# EAGLE design SatelliteDevBoard (EAGLE 7.7.0)
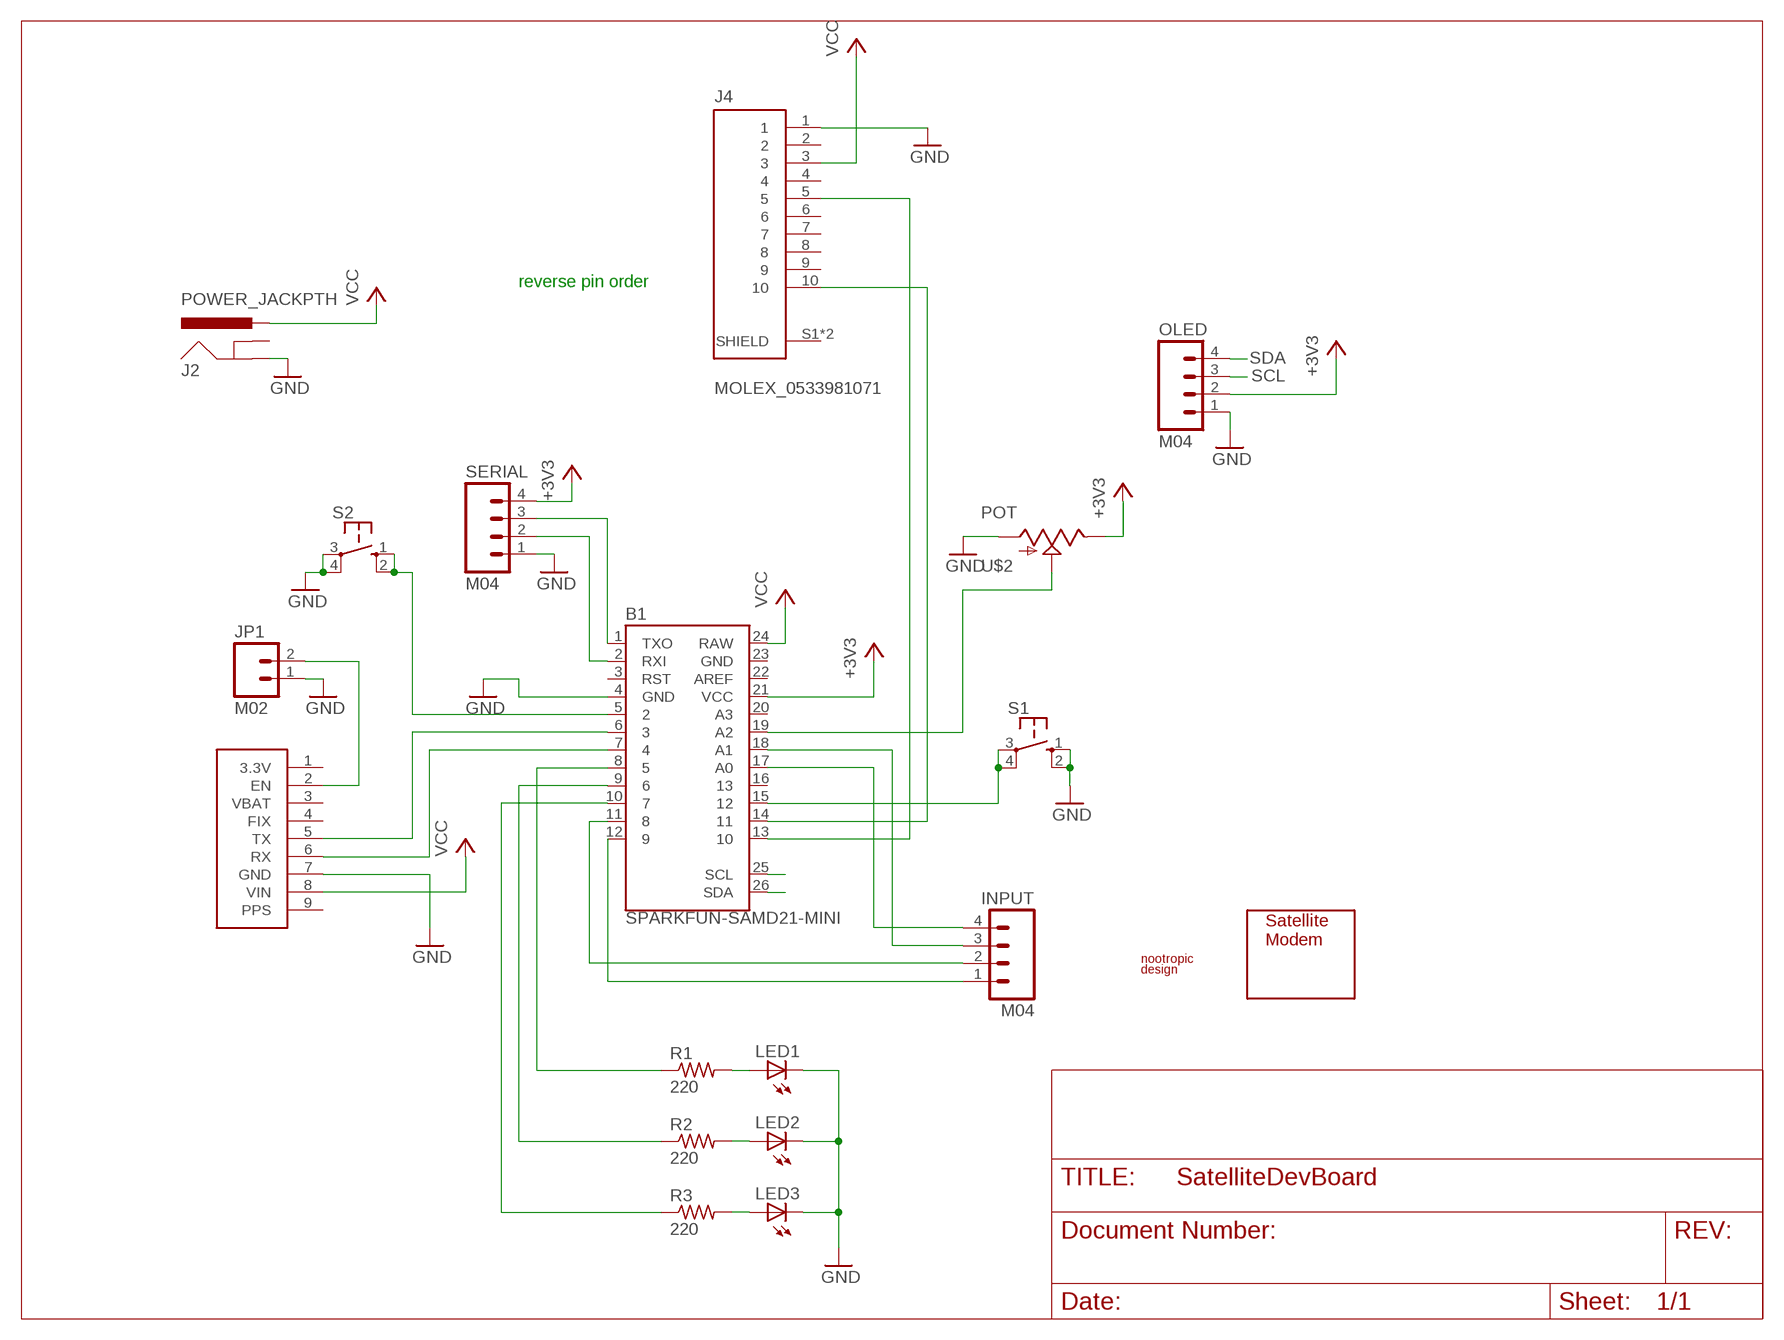
[diagram p0: schematic, sheet 1]

## Parts
B1  SPARKFUN-SAMD21-MINI  [SPARKFUN-SAMD21-MINI]
INPUT  M04  [1X04]
J2  POWER_JACKPTH  [POWER_JACK_PTH]
J4  MOLEX_0533981071  [MOLEX_0533981071]
JP1  M02  [1X02]
LED1  LED3MM  [LED3MM]
LED2  LED3MM  [LED3MM]
LED3  LED3MM  [LED3MM]
OLED  M04  [1X04]
R1  220  R-US  [0207/10]
R2  220  R-US  [0207/10]
R3  220  R-US  [0207/10]
S1  SWITCH-TACT  [SWITCH-TACT]
S2  SWITCH-TACT  [SWITCH-TACT]
SERIAL  M04  [1X04]
U$1  ROCKBLOCK-9603  [ROCKBLOCK-9603]
U$2  POT  [TRIMMERPOT]
U$3  ADAFRUIT-ULTIMATE-GPS-MODULE  [ADAFRUIT-ULTIMATE-GPS]
U$4  LOGO  [LOGO_SMALL]

## Nets
+3V3: B1.21(VCC) OLED.2 SERIAL.4 U$2.3
A0: B1.17(A0) INPUT.4
A1: B1.18(A1) INPUT.3
D5: B1.8 R1.1
D6: B1.9 R2.1
D7: B1.10 R3.1
D8: B1.11 INPUT.2
D9: B1.12 INPUT.1
D12: B1.15 S1.3(P) S1.4(P1)
GND: B1.4(GND) J2.GND J4.1 JP1.1 LED1.K(C) LED2.K(C) LED3.K(C) OLED.1 S1.1(S) S1.2(S1) S2.3(P) S2.4(P1) SERIAL.1 U$2.1 U$3.7(GND)
MODEM_RX: B1.13 J4.5
MODEM_TX: B1.14 J4.10
N$1: LED1.A R1.2
N$2: LED2.A R2.2
N$3: JP1.2 U$3.2(EN)
N$4: B1.6 U$3.5(TX)
N$5: B1.7 U$3.6(RX)
N$7: LED3.A R3.2
N$9: B1.5 S2.1(S) S2.2(S1)
N$12: B1.19(A2) U$2.2(WIPER)
RX: B1.2(RXI) SERIAL.2
SCL: B1.25(SCL) OLED.3
SDA: B1.26(SDA) OLED.4
TX: B1.1(TXO) SERIAL.3
VCC: B1.24(RAW) J2.PWR J4.3 U$3.8(VIN)
Unconnected: B1.3(RST) B1.16 B1.20(A3) B1.22(AREF) J2.GNDBREAK J4.2 J4.4 J4.6 J4.7 J4.8 J4.9 J4.S1(SHIELD) J4.S2(SHIELD) U$2.4(WIPER) U$3.1(3.3V) U$3.4(FIX) U$3.9(PPS)

## Notes on the sheet
- reverse pin order

## Power pins joined to a net without a drawn wire
GND: B1.23(GND)
VBAT: U$3.3(VBAT)

## Library data of the parts
B1 = nootropicdesign:SPARKFUN-SAMD21-MINI: SparkFun Pro Mini Pro Mini compatible footprint. Dimensions: 0.7 x 1.3" PCB Thickness: 0.8mm SparkFun Products: 3.3V/8MHz <https://www.sparkfun.com/products/11114> 5V/16MHz <https://www.sparkfun.com/products/11113>
INPUT OLED SERIAL = nootropicdesign:M04: 4-pin header
J2 = nootropicdesign:POWER_JACK: Power Jack This is the standard 5.5mm barrel jack for power. The PTH is the most common, proven, reliable, footprint. The Slot footprint only works if the mill layer is transmitted to the PCB fab house so be warned. Spark Fun Electronics SKU : PRT-00119 SMT: CONN-08106 Mating wall wart : TOL-00298 (and others)
J4 = nootropicdesign:MOLEX_0533981071: CONN HEADER 10POS 1.25MM VERT SMD
JP1 = nootropicdesign:M02: 2-pin header
LED1-LED3 = nootropicdesign:LED: LED OSRAM: - CHIPLED LG R971, LG N971, LY N971, LG Q971, LY Q971, LO R971, LY R971 LH N974, LH R974 LS Q976, LO Q976, LY Q976 LO Q996 - Hyper CHIPLED LW Q18S LB Q993, LB Q99A, LB R99A - SideLED LS A670, LO A670, LY A670, LG A670, LP A670 LB A673, LV A673, LT A673, LW A673 LH A674 LY A675 LS A676, LA A676, LO A676, LY A676, LW A676 LS A679, LY A679, LG A679 - Hyper Micro SIDELED® LS Y876, LA Y876, LO Y876, LY Y876 LT Y87S - SmartLED LW L88C, LW L88S LB L89C, LB L89S, LG L890 LS L89K, LO L89K, LY L89K LS L896, LA L896, LO L896, LY L896 - TOPLED LS T670, LO T670, LY T670, LG T670, LP T670 LSG T670, LSP T670, LSY T670, LOP T670, LYG T670 LG T671, LOG T671, LSG T671 LB T673, LV T673, LT T673, LW T673 LH T674 LS T676, LA T676, LO T676, LY T676, LB T676, LH T676, LSB T676, LW T676 LB T67C, LV T67C, LT T67C, LS T67K, LO T67K, LY T67K, LW E67C LS E67B, LA E67B, LO E67B, LY E67B, LB E67C, LV E67C, LT E67C LW T67C LS T679, LY T679, LG T679 LS T770, LO T770, LY T770, LG T770, LP T770 LB T773, LV T773, LT T773, LW T773 LH T774 LS E675, LA E675, LY E675, LS T675 LS T776, LA T776, LO T776, LY T776, LB T776 LHGB T686 LT T68C, LB T68C - Hyper Mini TOPLED® LB M676 - Mini TOPLED Santana® LG M470 LS M47K, LO M47K, LY M47K Source: http://www.osram.convergy.de/
R1-R3 = nootropicdesign:R-US: Resistor
S1 S2 = nootropicdesign:SWITCH-TACT: 12MM Tactile Switch
U$1 = nootropicdesign:ROCKBLOCK-9603
U$2 = nootropicdesign:POT
U$3 = nootropicdesign:ADAFRUIT-ULTIMATE-GPS-MODULE
U$4 = nootropicdesign:LOGO

## Board
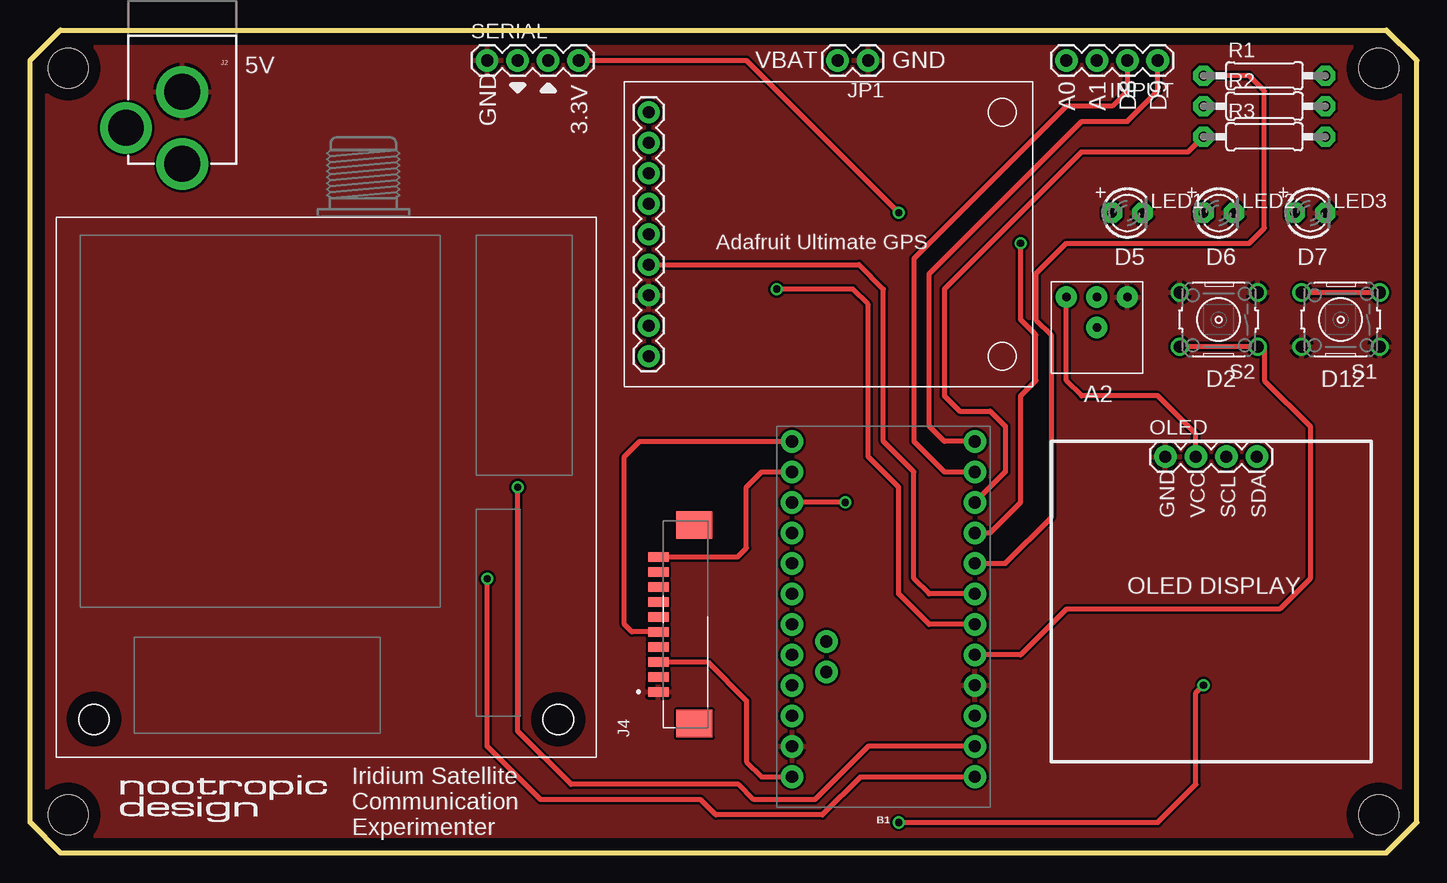
[diagram p1: board, top side]
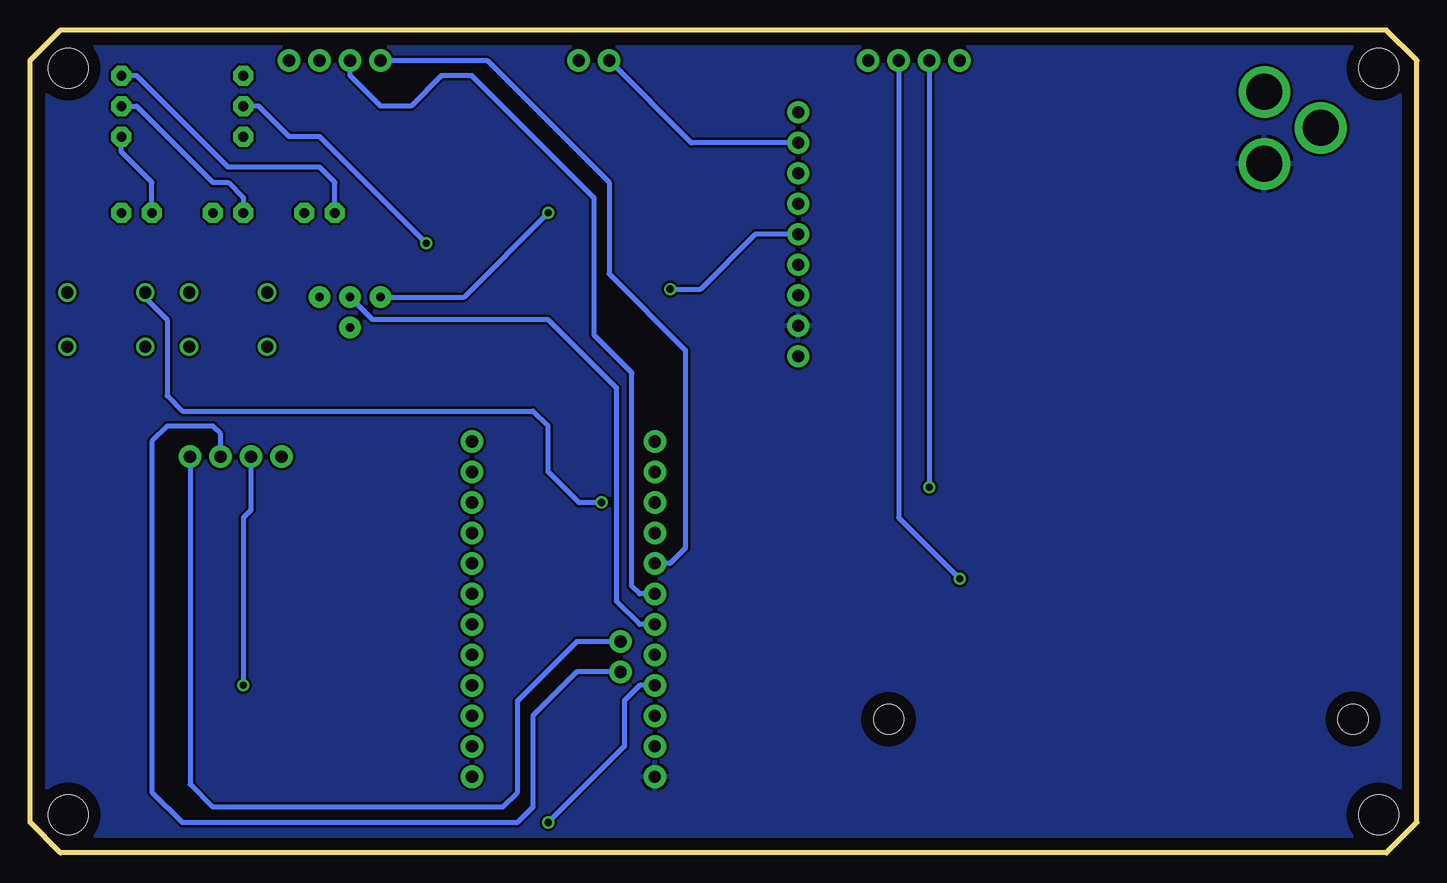
[diagram p2: board, bottom side, seen from below]

Size 115.57 x 68.58 mm. Coordinates in mm from the lower left corner, seen from the top.
Outline: 0,2.54 2.54,0 113.03,0 115.57,2.54 115.57,66.04 113.03,68.58 2.54,68.58 0,66.04 0,2.54
Copper layers (1*16): Top 0.035mm / dielectric 1.5mm / Bottom 0.035mm
Design rules "default *": minimum track width 10mil, minimum drill 20mil, track to track 8mil, track to pad 8mil, pad to pad 8mil, via to via 8mil, smd to smd 8mil, copper to edge 40mil, drill to drill 8mil, minimum pad ring 10mil, minimum via ring 8mil, stop-mask expansion 4mil, vias tented up to drill 0mil, thermal gap 10mil
Holes 2.5 mm at 5.32,11.15 44.02,11.14
Holes 3.3 mm at 3.17,3.17 112.39,3.17 3.17,65.41 112.39,65.41

### Footprints (pad centres in the part's own frame; a part is rotated, then mirrored left to right if it is on the bottom)
SPARKFUN-SAMD21-MINI = drill 1.016 pad 1.88: 1 -7.62,12.7; 2 -7.62,10.16; 3 -7.62,7.62; 4 -7.62,5.08; 5 -7.62,2.54; 6 -7.62,0; 7 -7.62,-2.54; 8 -7.62,-5.08; 9 -7.62,-7.62; 10 -7.62,-10.16; 11 -7.62,-12.7; 12 -7.62,-15.24; 13 7.62,-15.24; 14 7.62,-12.7; 15 7.62,-10.16; 16 7.62,-7.62; 17 7.62,-5.08; 18 7.62,-2.54; 19 7.62,0; 20 7.62,2.54; 21 7.62,5.08; 22 7.62,7.62; 23 7.62,10.16; 24 7.62,12.7; 25 4.763,3.969; 26 4.763,1.429
1X04 = drill 1.016 pad 1.88: 1 -3.81,0; 2 -1.27,0; 3 1.27,0; 4 3.81,0
POWER_JACK_PTH = drill 2.997 pad 4.318: GND 0,7.7; GNDBREAK 4.7,10.7; PWR 0,13.7
MOLEX_0533981071 = smd 0.8 x 1.7: 1 -5.625,0.975; 2 -4.375,0.975; 3 -3.125,0.975; 4 -1.875,0.975; 5 -0.625,0.975; 6 0.625,0.975; 7 1.875,0.975; 8 3.125,0.975; 9 4.375,0.975; 10 5.625,0.975 | smd 2.3 x 3: S1 -8.275,-2.025; S2 8.275,-2.025
1X02 = drill 1.016 pad 1.88: 1 0,0; 2 2.54,0
LED3MM = drill 0.813 pad 1.676 octagon: A -1.27,0; K 1.27,0
0207/10 = drill 0.813 pad 1.676 octagon: 1 -5.08,0; 2 5.08,0
SWITCH-TACT = drill 1.016: 1 -3.251,2.261; 2 3.251,2.261; 3 -3.251,-2.261; 4 3.251,-2.261
TRIMMERPOT = drill 0.711 pad 1.778: 1 2.54,-2.54; 2 2.54,0; 3 2.54,2.54; 4 0,0
ADAFRUIT-ULTIMATE-GPS = drill 1.016 pad 1.829: 1 2.032,22.86; 2 2.032,20.32; 3 2.032,17.78; 4 2.032,15.24; 5 2.032,12.7; 6 2.032,10.16; 7 2.032,7.62; 8 2.032,5.08; 9 2.032,2.54

### Placement (x,y rotation side)
B1  71.12,19.05 180 top
INPUT  90.17,66.04 180 top
J2  12.7,71.12 180 top
J4  53.34,19.05 90 top
JP1  69.85,66.04 180 top
LED1  91.44,53.34 0 top
LED2  99.06,53.34 0 top
LED3  106.68,53.34 0 top
OLED  98.42,33.02 0 top
R1  102.87,64.77 0 top
R2  102.87,62.23 0 top
R3  102.87,59.69 0 top
S1  109.22,44.45 180 top
S2  99.06,44.45 180 top
SERIAL  41.91,66.04 0 top
U$1  24.67,30.48 90 top
U$2  88.9,43.79 90 top
U$3  49.53,38.86 0 top
U$4  7.52,2.57 0 top

### Tracks (layer width: path | path; a pad name or v marks a point on that pad's centre or on a via)
+3V3  (via drill 0.6)
  Top 0.406: v72.39,2.54 93.98,2.54 97.16,5.71 97.16,13.34 v97.79,13.97 | OLED.2 97.16,34.92 93.98,38.1 87.63,38.1 86.36,39.37 U$2.3 | SERIAL.4 59.69,66.04 v72.39,53.34
  Bottom 0.406: OLED.2 97.16,28.57 97.79,27.94 v97.79,13.97 | B1.21 64.77,13.97 66.04,12.7 66.04,8.89 v72.39,2.54 | U$2.3 79.4,46.33 v72.39,53.34
A0
  Bottom 0.406: INPUT.4 77.47,66.04 67.31,55.88 67.31,48.26 60.96,41.91 60.96,25.4 62.23,24.13 B1.17
A1
  Bottom 0.406: INPUT.3 88.9,64.77 86.36,62.23 83.82,62.23 81.28,64.77 78.74,64.77 68.58,54.61 68.58,43.18 65.41,40.01 65.41,22.23 64.77,21.59 B1.18
D5
  Top 0.406: B1.8 81.28,24.13 85.09,27.94 85.09,43.18 83.82,44.45 83.82,48.26 86.36,50.8 101.6,50.8 102.87,52.07 102.87,63.5 101.6,64.77 R1.1
D6  (via drill 0.6)
  Top 0.406: B1.9 80.01,26.67 82.55,29.21 82.55,38.1 83.82,39.37 83.82,43.18 82.55,44.45 v82.55,50.8
  Bottom 0.406: v82.55,50.8 91.44,59.69 93.98,59.69 96.52,62.23 R2.1
D7
  Top 0.406: R3.1 96.52,58.42 87.63,58.42 76.2,46.99 76.2,38.1 77.47,36.83 80.01,36.83 81.28,35.56 81.28,31.75 B1.10
D8
  Top 0.406: INPUT.2 91.44,63.5 90.17,62.23 86.36,62.23 73.66,49.53 73.66,34.29 76.2,31.75 B1.11
D9
  Top 0.406: B1.12 76.2,34.29 74.93,35.56 74.93,48.26 87.63,60.96 91.44,60.96 93.98,63.5 INPUT.1
D12  (via drill 0.6)
  Top 0.406: S1.4 S1.3 | v67.94,29.21 B1.15
  Bottom 0.406: S1.4 105.97,46.28 104.14,44.45 104.14,38.1 102.87,36.83 73.66,36.83 72.39,35.56 72.39,31.75 69.85,29.21 v67.94,29.21
GND
  pour Top: 0.64,3.17 3.17,0.64 112.39,0.64 114.94,3.17 114.94,65.41 112.39,67.94 3.17,67.94 0.64,65.41
MODEM_RX
  Top 0.406: J4.5 50.16,18.43 49.53,19.05 49.53,33.02 50.8,34.29 B1.13
MODEM_TX
  Top 0.406: J4.10 58.97,24.68 59.69,25.4 59.69,30.48 60.96,31.75 B1.14
N$1
  Bottom 0.406: LED1.A 90.17,55.88 91.44,57.15 99.06,57.15 106.68,64.77 R1.2
N$2
  Bottom 0.406: R2.2 106.68,62.23 100.33,55.88 99.06,55.88 97.79,54.61 LED2.A
N$3
  Bottom 0.406: JP1.2 60.45,59.18 U$3.2
N$4  (via drill 0.6)
  Top 0.406: B1.6 74.93,19.05 72.39,21.59 72.39,30.48 69.85,33.02 69.85,45.72 68.58,46.99 v62.23,46.99
  Bottom 0.406: v62.23,46.99 59.69,46.99 55.12,51.56 U$3.5
N$5
  Top 0.406: B1.7 74.93,21.59 73.66,22.86 73.66,31.75 71.12,34.29 71.12,46.99 69.09,49.02 U$3.6
N$7
  Bottom 0.406: LED3.A 105.41,55.88 107.95,58.42 R3.2
N$9
  Top 0.406: B1.5 82.55,16.51 86.36,20.32 104.14,20.32 106.68,22.86 106.68,35.56 102.87,39.37 102.87,41.91 102.59,42.19 S2.1 S2.2
N$12
  Bottom 0.406: U$2.2 87.02,44.45 72.39,44.45 66.67,38.73 66.67,20.95 64.77,19.05 B1.19
RX  (via drill 0.6)
  Top 0.406: B1.2 69.85,8.89 65.41,4.45 60.33,4.45 59.05,5.71 45.09,5.71 40.64,10.16 v40.64,30.48
  Bottom 0.406: SERIAL.2 v40.64,30.48
SCL
  Bottom 0.406: OLED.3 99.69,34.92 100.33,35.56 104.14,35.56 105.41,34.29 105.41,5.08 102.87,2.54 74.93,2.54 73.66,3.81 73.66,11.43 70.01,15.08 B1.25
SDA
  Bottom 0.406: OLED.4 102.23,5.71 100.33,3.81 76.2,3.81 74.93,5.08 74.93,12.7 70.01,17.62 B1.26
TX  (via drill 0.6)
  Top 0.406: B1.1 69.22,6.35 66.04,3.17 57.15,3.17 55.88,4.45 42.55,4.45 38.1,8.89 v38.1,22.86
  Bottom 0.406: SERIAL.3 43.18,27.94 v38.1,22.86
VCC
  Top 0.406: J4.3 56.47,15.93 59.69,12.7 59.69,7.62 60.96,6.35 B1.24
  pour Bottom: 0.64,3.17 3.17,0.64 112.39,0.64 114.94,3.17 114.94,65.41 112.39,67.94 3.17,67.94 0.64,65.41

### Text on the board
tPlace: 5V | VBAT | GND | A0 | A1 | D8 | D9 | GND | 3.3V | D5 | D6 | D7 | D2 | D12 | A2 | GND | VCC | SCL | SDA | OLED DISPLAY | Iridium Satellite / Communication / Experimenter
tDocu: 1